# Altium schematic sheet 18 ADC_TF_Debug.SchDoc
size 420 x 297 mm
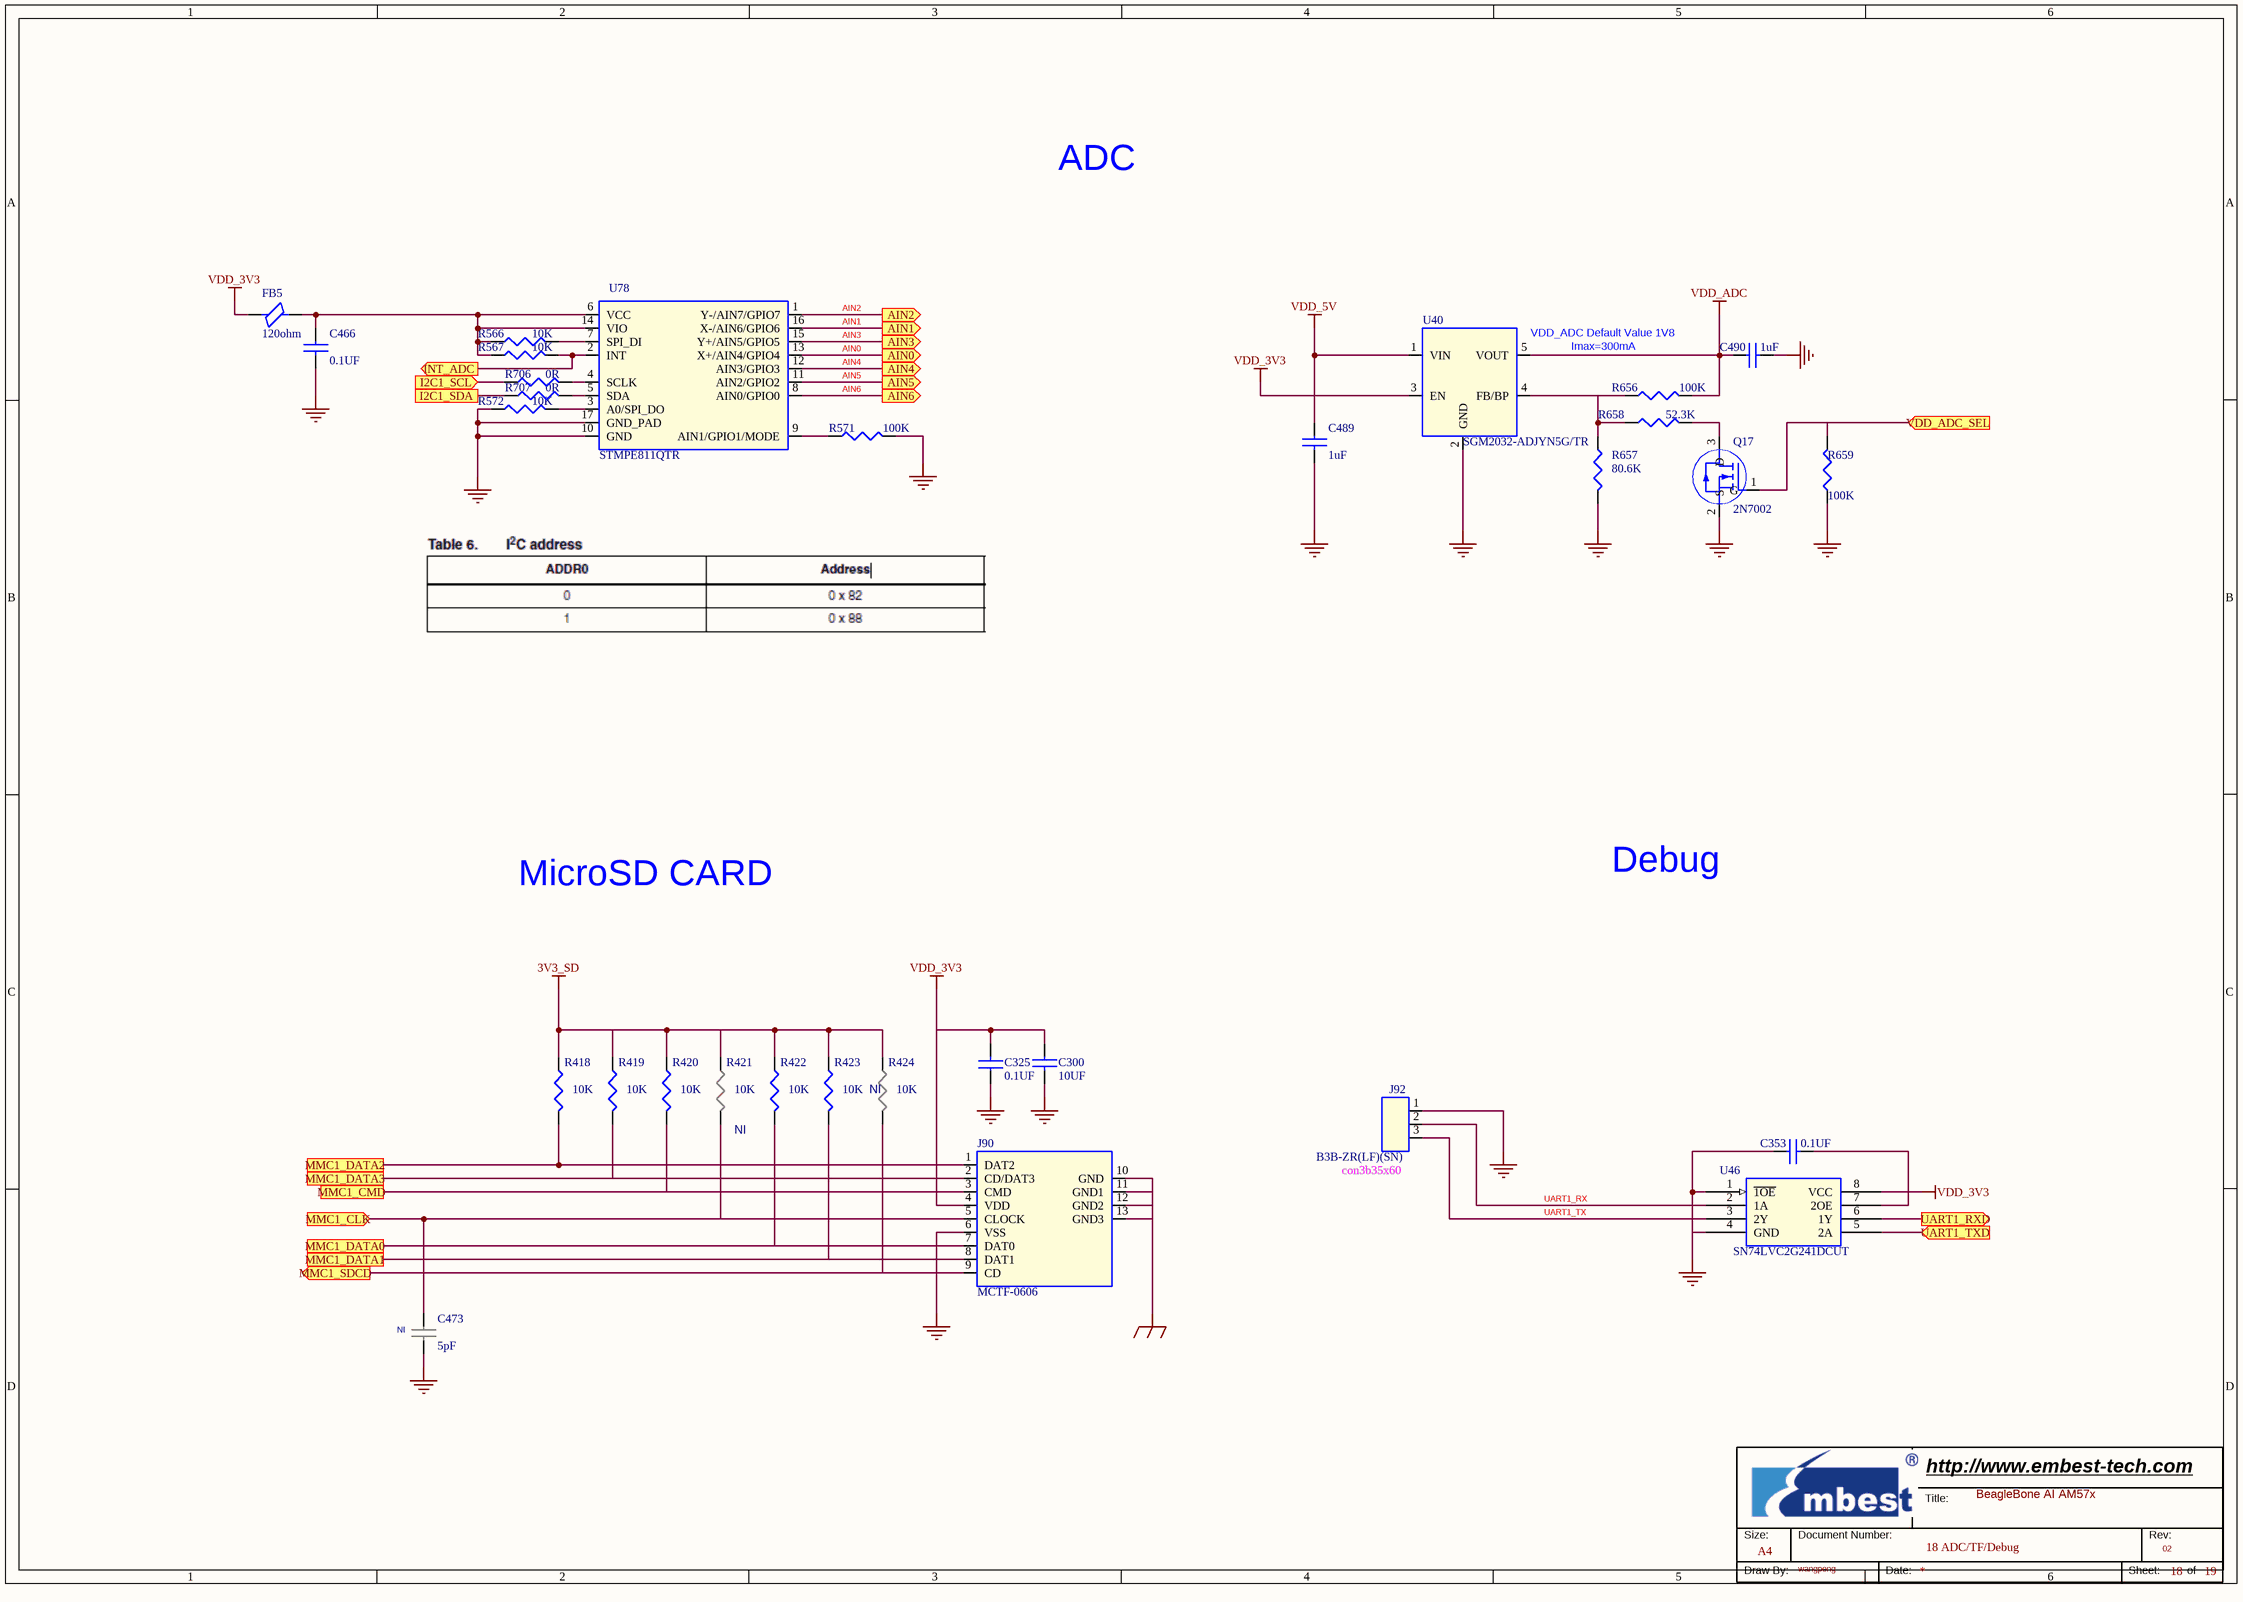
[diagram p0: 18 ADC_TF_Debug.SchDoc]

## Parts
*  Page Count: 19  Page Number: 18  Page Size: A4  Title: BeagleBone AI AM57x  RevCode: 02  Doc: 18 ADC/TF/Debug  Drawing: wangpeng  (hidden comment: Embest Title)  (graphical)
C300  10UF  [C0603]
C325  0.1UF  [C0402]
C353  0.1UF  [C0402]
C466  0.1UF  [C0402]
C473  5pF  ASSY: NI  [C0402]
C489  1uF  [C0402]
C490  1uF  [C0402]
FB5  120ohm  [L0402]
J90  MCTF-0606  [SD_HSF-COMPLIANT_MCTF-0606]
J92  B3B-ZR(LF)(SN)  [con3b35x60]
Q17  2N7002  [SOT23_123]
R418  10K  [R0402]
R419  10K  [R0402]
R420  10K  [R0402]
R421  10K  ASSY: NI  [R0402]
R422  10K  [R0402]
R423  10K  [R0402]
R424  10K  ASSY: NI  [R0402]
R566  10K  [R0402]
R567  10K  [R0402]
R571  100K  [R0402]
R572  10K  [R0402]
R656  100K  [R0402]
R657  80.6K  [R0402]
R658  52.3K  [R0402]
R659  100K  [R0402]
R706  0R  [R0402]
R707  0R  [R0402]
U40  SGM2032-ADJYN5G/TR  [SOT23_5]
U46  SN74LVC2G241DCUT  [vssop8cr]
U78  STMPE811QTR  [QFN50P300X300X100-17N]

## Ports
AIN0 (out), AIN1 (out), AIN2 (out), AIN3 (out), AIN4 (out), AIN5 (out), AIN6 (out), I2C1_SCL (in), I2C1_SDA, INT_ADC (out), MMC1_CLK (in), MMC1_CMD, MMC1_DATA0, MMC1_DATA1, MMC1_DATA2, MMC1_DATA3, MMC1_SDCD (out), UART1_RXD (out), UART1_TXD (in), VDD_ADC_SEL (in)

## Nets
3V3_SD: R418.1 R419.1 R420.1 R421.1 R422.1 R423.1 R424.1
GND: C300.2 C325.1 C353.1 C466.2 C473.2 C489.2 C490.2 J90.6(VSS) J92.1 Q17.2(S) R571.2 R572.1 R657.2 R659.1 U40.2(GND) U46.1(~{1OE}) U46.4(GND) U78.10(GND) U78.17(GND_PAD)
GND_EARTH: J90.10(GND) J90.11(GND1) J90.12(GND2) J90.13(GND3)
VDD_3V3: C300.1 C325.2 FB5.1 J90.4(VDD) U40.3(EN) U46.8(VCC)
VDD_5V: C489.1 U40.1(VIN)
VDD_ADC: C490.1 R656.2 U40.5(VOUT)
AIN0: U78.13(X+/AIN4/GPIO4) ; port AIN0
AIN1: U78.16(X-/AIN6/GPIO6) ; port AIN1
AIN2: U78.1(Y-/AIN7/GPIO7) ; port AIN2
AIN3: U78.15(Y+/AIN5/GPIO5) ; port AIN3
AIN4: U78.12(AIN3/GPIO3) ; port AIN4
AIN5: U78.11(AIN2/GPIO2) ; port AIN5
AIN6: U78.8(AIN0/GPIO0) ; port AIN6
I2C1_SCL: R706.1 ; port I2C1_SCL
I2C1_SDA: R707.1 ; port I2C1_SDA
INT_ADC: R567.2 U78.2(INT) ; port INT_ADC
MMC1_CLK: C473.1 J90.5(CLOCK) R421.2 ; port MMC1_CLK
MMC1_CMD: J90.3(CMD) R420.2 ; port MMC1_CMD
MMC1_DATA0: J90.7(DAT0) R422.2 ; port MMC1_DATA0
MMC1_DATA1: J90.8(DAT1) R423.2 ; port MMC1_DATA1
MMC1_DATA2: J90.1(DAT2) R418.2 ; port MMC1_DATA2
MMC1_DATA3: J90.2(CD/DAT3) R419.2 ; port MMC1_DATA3
MMC1_SDCD: J90.9(CD) R424.2 ; port MMC1_SDCD
UART1_RX: J92.2 U46.2(1A)
UART1_RXD: U46.6(1Y) ; port UART1_RXD
UART1_TX: J92.3 U46.3(2Y)
UART1_TXD: U46.5(2A) ; port UART1_TXD
VDD_ADC_SEL: Q17.1(G) R659.2 ; port VDD_ADC_SEL
NetC353_2: C353.2 U46.7(2OE)
NetC466_1: C466.1 FB5.2 R566.1 R567.1 U78.6(VCC) U78.14(VIO)
NetQ17_3: Q17.3(D) R658.2
NetR566_2: R566.2 U78.7(SPI_DI)
NetR571_1: R571.1 U78.9(AIN1/GPIO1/MODE)
NetR572_2: R572.2 U78.3(A0/SPI_DO)
NetR656_1: R656.1 R657.1 R658.1 U40.4(FB/BP)
NetR706_2: R706.2 U78.4(SCLK)
NetR707_2: R707.2 U78.5(SDA)

## Notes on the sheet
- ADC
- (near U40) VDD_ADC Default Value 1V8
- Imax=300mA
- MicroSD CARD
- Debug
- (in symbol Embest Title) Title:; Size:; Document Number:; Rev:; Draw By:; Date:; Sheet:; of

## Library data of the parts
C300 = C: CAP,10UF,+/-10%,X5R,10V,SMD0603; Manufacturer Part Number: GRM188R61A106KE69D; Manufacturer: Murata; Embest PN: 1004001100129; Datasheet: Y:\ÐÂK3ÏµÍ³ÎïÁÏdatasheet\[1003_1004]capacitor-resistor µçÈÝ¡¢µç×è\1004001100129T2 C1608X5R1A106M.pdf; Part Type: Ceramic Capacitor
C325 C353 = C: CAP,100NF,+/-10%,X7R,16V,SMD0402; Manufacturer: Murata; Manufacturer Part Number: GRM155R71C104KA88D; Embest PN: 1004001100047; Part Type: Ceramic Capacitor; Datasheet: Y:\ÐÂK3ÏµÍ³ÎïÁÏdatasheet\[1003_1004]capacitor-resistor µçÈÝ¡¢µç×è\1004001100047-GRM155R71C104KA88D.pdf
C466 = C: CAP,100NF,+/-10%,X7R,16V,SMD0402; Manufacturer Part Number: GRM155R71C104KA88D; Manufacturer: Murata; Embest PN: 1004001100047; Datasheet: Y:\ÐÂK3ÏµÍ³ÎïÁÏdatasheet\[1003_1004]capacitor-resistor µçÈÝ¡¢µç×è\1004001100047-GRM155R71C104KA88D.pdf; Part Type: Ceramic Capacitor
C473 = C: CAP,5PF,+/-0.25PF,C0G,50V,SMD0402; Manufacturer Part Number: GRM1555C1H5R0CA01D; Manufacturer: Murata; Embest PN: 1004001100004; Part Type: Ceramic Capacitor
C489 = C: CAP,1UF,+/-10%,X5R,10V,SMD0402; Manufacturer: Murata; Manufacturer Part Number: GRM155R61A105KE15D; Embest PN: 1004001100057; Part Type: Ceramic Capacitor
C490 = C: CAP,1UF,+/-10%,X5R,10V,SMD0402; Manufacturer Part Number: GRM155R61A105KE15D; Manufacturer: Murata; Embest PN: 1004001100057; Part Type: Ceramic Capacitor
FB5 = FB: Ferrite Bead,120ohm@100MHz,+/-25%,1300mA,90mohm,SMD0402; Manufacturer: Murata; Manufacturer Part Number: BLM15PD121SN1D; Embest PN: 1005005100058; Part Type: Ferrite Bead
J90 = MCTF-0606: Card Connector MCTF-0606 Connector,MicroSD Card CONN with detect switch,Gold Flash 1u,Black,SMD MTCONN Hamster AM572x; Manufacturer: HSF; Embest PN: 1009017100086; PCB Footprint: SD_HSF-COMPLIANT_MCTF-0606; Part Type: Card Connector; Manufacturer Part Number: MCTF-0606; Status: Hamster AM572x; Datasheet: Y:\ÐÂK3ÏµÍ³ÎïÁÏdatasheet\[1009]connectors Á¬½ÓÆ÷\1009017100086 MCTF-0606.pdf
J92 = SIP3: Connector, Wire-To-Board Top Entry, ZH Series, Through Hole, Header, 3PIN, 1.5 mm, Tin Plated Contacts; Manufacturer: JST; Embest PN: 1009014200068; PCB Footprint: con3b35x60; Part Type: Terminal Block; Manufacturer Part Number: B3B-ZR(LF)(SN); Status: TBD; Datasheet: Y:\ÐÂK3ÏµÍ³ÎïÁÏdatasheet\[1009]connectors Á¬½ÓÆ÷\1009014200068 B3B-ZR(LF)(SN).pdf
Q17 = NMOS: Mosfet,N-Channel,2N7002,60V,115mA,SOT-23,SMD; Manufacturer: FAIRCHILD; Embest PN: 1006015100003; Datasheet: Y:\ÐÂK3ÏµÍ³ÎïÁÏdatasheet\[1006014~16]mosfet ³¡Ð§Ó¦¹Ü\1006015100003 2n7002 Fairchild.pdf; Manufacturer Part Number: 2N7002; Part Type: MOSFET
R418-R424 = R: RES,10K,+/-1%,1/16W,SMD0402; Manufacturer: YAGEO; Manufacturer Part Number: RC0402FR-0710KL; Embest PN: 1003001100071; Part Type: Thick film Resistor
R566 R572 = R: RES,10K,+/-5%,1/16W,SMD0402; Manufacturer Part Number: RC0402JR-0710KL; Manufacturer: YAGEO; Embest PN: 1003001100072; Part Type: Thick film Resistor
R567 = R: RES,10K,+/-5%,1/16W,SMD0402; Manufacturer: YAGEO; Manufacturer Part Number: RC0402JR-0710KL; Embest PN: 1003001100072; Part Type: Thick film Resistor
R571 = R: RES,100K,+/-5%,1/16W,SMD0402; Manufacturer Part Number: RC0402JR-07100KL; Manufacturer: YAGEO; Embest PN: 1003001100119; Part Type: Thick film Resistor
R656 = R: RES,100K,+/-1%,1/16W,SMD0402; Manufacturer: YAGEO; Manufacturer Part Number: RC0402FR-07100KL; Embest PN: 1003001100120; Part Type: Thick film Resistor
R657 = R: RES,80K6,+/-1%,1/16W,SMD0402; Manufacturer Part Number: RC0402FR-0780K6L; Manufacturer: YAGEO; Embest PN: 1003001100565; Part Type: Thick film Resistor
R658 = R: RES,52K3,+/-1%,1/16W,SMD0402; Manufacturer: YAGEO; Manufacturer Part Number: RC0402FR-0752K3L; Embest PN: 1003001100107; Part Type: Thick film Resistor
R659 = R: RES,100K,+/-1%,1/16W,SMD0402; Manufacturer Part Number: RC0402FR-07100KL; Manufacturer: YAGEO; Embest PN: 1003001100120; Part Type: Thick film Resistor
R706 R707 = R: RES,0R,+/-5%,1/16W,SMD0402; Manufacturer Part Number: RC0402JR-070RL; Manufacturer: YAGEO; Embest PN: 1003001100001; Part Type: Thick film Resistor
U40 = SGM2032: IC,300mA Low Power Low Dropout RF Linear Regulators,SGM2032-ADJYN5G/TR,SOT23-5,SMD; Manufacturer: KINGSTON; Embest PN: 1002006100080; Datasheet: Y:\ÐÂK3ÏµÍ³ÎïÁÏdatasheet\[1002]IC ¼¯³ÉµçÂ·\1002006100080_SGM2032_SG-Micro.pdf; Manufacturer Part Number: SGM2032-ADJYN5G/TR; Part Type: LDO
U46 = SN74LVC2G241DCUT: IC,Dual Buffer and Line Driver,SN74LVC2G241DCUT,US8,SMD; Manufacturer: TI; PN: 1002008100076; Status: AVL; Manufacturer Part Number: SN74LVC2G241DCUT; Part Type: Logic; Embest PN: 1002008100076
U78 = STMPE811QTR: 12 bit ADC,S-Touch? advanced resistive touchscreen controller with 8-bit GPIO expander; Manufacturer: STMicroelectronics; Embest PN: 1002020100004; PCB Footprint: QFN50P300X300X100-17N; Part Type: IC; Manufacturer Part Number: STMPE811QTR; Status: Hamster AM572x; Datasheet: Y:\ÐÂK3ÏµÍ³ÎïÁÏdatasheet\[1002]IC ¼¯³ÉµçÂ·\1002020100004_STMPE811_ST.pdf
* = Embest Title: Page Create Date: May 29, 2006; WebSite: http://www.embest-tech.com; Company: Embest; Page Modify Date: *